# Altium schematic sheet dsPIC.SchDoc: Oncilla motor control board
size A4; DocumentNumber: 3; Revision: 3; SheetNumber: 3; SheetTotal: 5
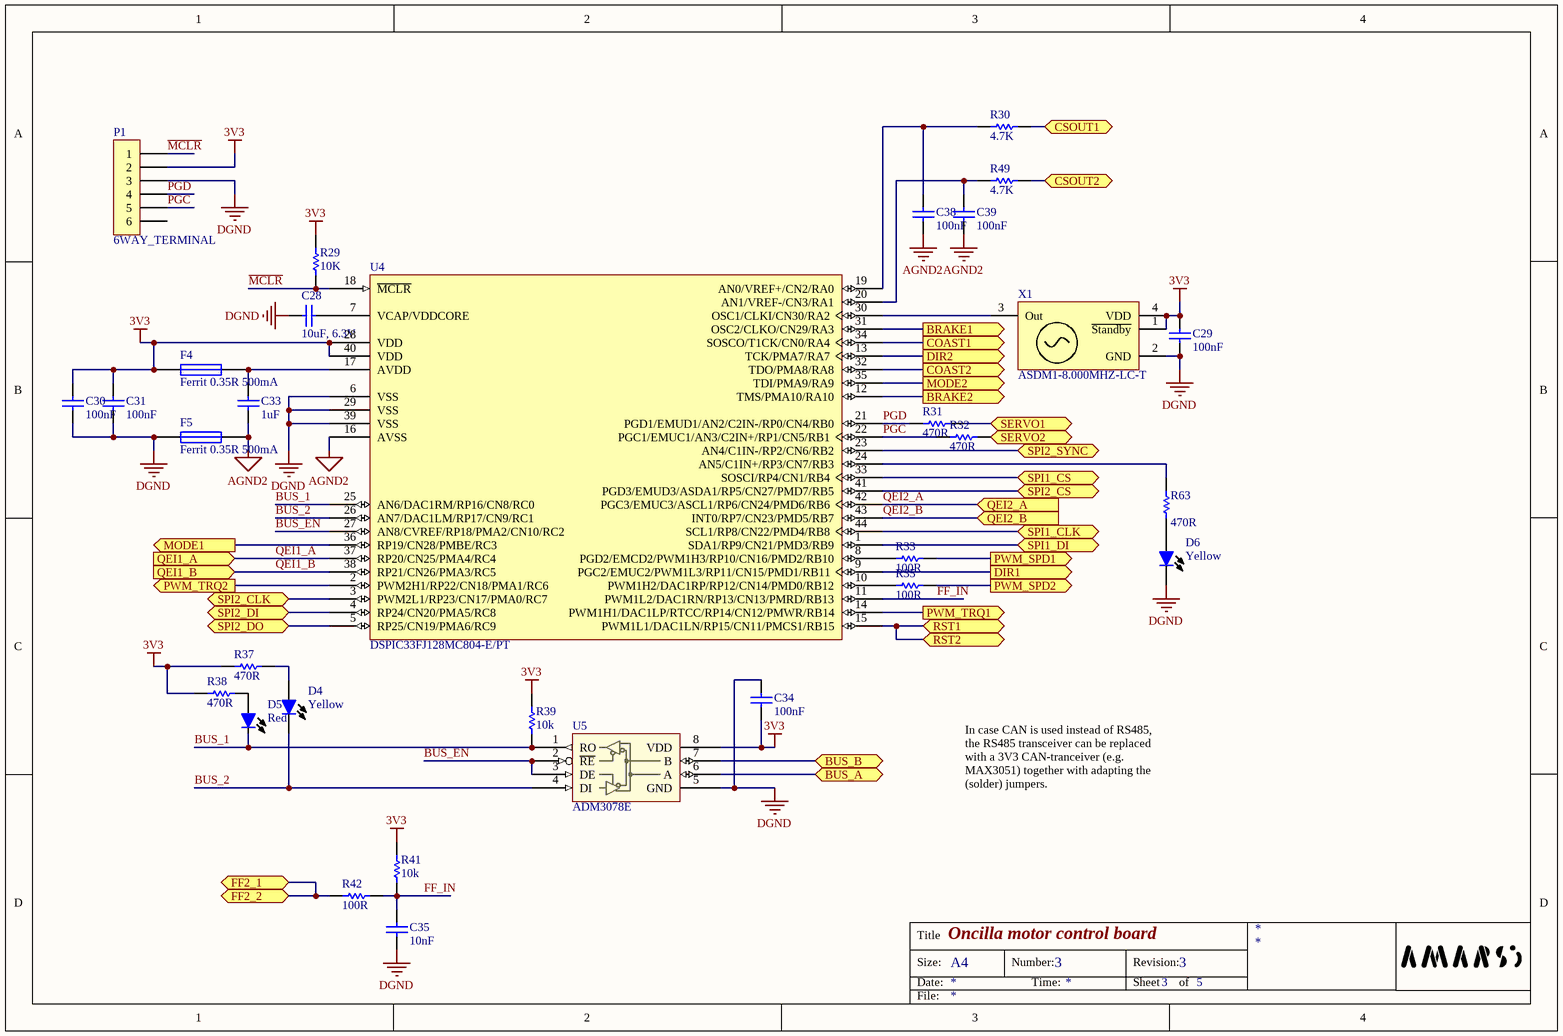
[diagram p0: dsPIC.SchDoc]

## Parts
C28  10uF, 6.3V  [CAPC1608L]
C29  100nF  [CAPC1608L]
C30  100nF  [CAPC1608L]
C31  100nF  [CAPC1608L]
C33  value 1uF  [CAPC1608L]  (hidden comment: 1uF, 25V)
C34  100nF  [CAPC1608L]
C35  10nF  [CAPC1608L]
C38  100nF  [CAPC1608L]
C39  100nF  [CAPC1608L]
D4  Color: Yellow  [CD1608-0603]  (hidden comment: LED Yellow)
D5  Color: Red  [CD1608-0603]  (hidden comment: LED Red)
D6  Color: Yellow  [CD1608-0603]  (hidden comment: LED Green)
F4  Ferrit 0.35R 500mA  [RESC1608L]
F5  Ferrit 0.35R 500mA  [RESC1608L]
P1  6WAY_TERMINAL  [MICROMATCH_6WAY_SE]
R29  10k  [RESC1608L]
R30  4.7k  [RESC1608L]
R31  470R  [RESC1608L]
R32  470R  [RESC1608L]
R33  100R  [RESC1608L]
R35  100R  [RESC1608L]
R37  470R  [RESC1608L]
R38  470R  [RESC1608L]
R39  10k  [RESC1608L]
R41  10k  [RESC1608L]
R42  100R  [RESC1608L]
R49  4.7k  [RESC1608L]
R63  470R  [RESC1608L]
U4  DSPIC33FJ128MC804-E/PT  [TQFP-PT44_N]
U5  ADM3078E  [SOIC-8_M]
X1  ASDM1-8.000MHZ-LC-T  [Crystal-Oscillator-2520]

## Ports
BRAKE1 (out), BRAKE2 (out), BUS_A, BUS_B, COAST1 (out), COAST2 (out), CSOUT1, CSOUT2, DIR1 (out), DIR2 (out), FF2_1, FF2_2, MODE1 (out), MODE2 (out), PWM_SPD1 (out), PWM_SPD2 (out), PWM_TRQ1 (out), PWM_TRQ2 (out), QEI1_A (in), QEI1_B (in), QEI2_A (in), QEI2_B (in), RST1, RST2, SERVO1 (bidir), SERVO2 (bidir), SPI1_CLK, SPI1_CS, SPI1_DI, SPI2_CLK, SPI2_CS, SPI2_DI, SPI2_DO, SPI2_SYNC

## Nets
3V3: C29.2 C30.2 C31.2 C34.1 F4.1 P1.2 R29.2 R37.1 R38.1 R39.2 R41.2 U4.28(VDD) U4.40(VDD) U5.8(VDD) X1.1(~{Standby}) X1.4(VDD)
AGND2: C33.1 C38.1 C39.1 F5.2 U4.16(AVSS)
DGND: C28.1 C29.1 C30.1 C31.1 C34.2 C35.1 D6.2(C) F5.1 P1.3 U4.6(VSS) U4.29(VSS) U4.39(VSS) U5.5(GND) X1.2(GND)
BRAKE1: U4.31(OSC2/CLKO/CN29/RA3) ; port BRAKE1
BRAKE2: U4.12(TMS/PMA10/RA10) ; port BRAKE2
BUS_1: D5.2(C) R39.1 U4.25(AN6/DAC1RM/RP16/CN8/RC0) U5.1(RO)
BUS_2: D4.2(C) U4.26(AN7/DAC1LM/RP17/CN9/RC1) U5.4(DI)
BUS_A: U5.6(A) ; port BUS_A
BUS_B: U5.7(B) ; port BUS_B
BUS_EN: U4.27(AN8/CVREF/RP18/PMA2/CN10/RC2) U5.2(~{RE}) U5.3(DE)
COAST1: U4.34(SOSCO/T1CK/CN0/RA4) ; port COAST1
COAST2: U4.32(TDO/PMA8/RA8) ; port COAST2
CSOUT1: R30.2 ; port CSOUT1
CSOUT2: R49.2 ; port CSOUT2
DIR1: U4.9(PGC2/EMUC2/PWM1L3/RP11/CN15/PMD1/RB11) ; port DIR1
DIR2: U4.13(TCK/PMA7/RA7) ; port DIR2
FF2_1: R42.2 ; port FF2_2, port FF2_1
FF_IN: C35.2 R41.1 R42.1 U4.11(PWM1L2/DAC1RN/RP13/CN13/PMRD/RB13)
~{MCLR}: P1.1 R29.1 U4.18(~{MCLR})
MODE1: U4.36(RP19/CN28/PMBE/RC3) ; port MODE1
MODE2: U4.35(TDI/PMA9/RA9) ; port MODE2
PGC: P1.5 R32.1 U4.22(PGC1/EMUC1/AN3/C2IN+/RP1/CN5/RB1)
PGD: P1.4 R31.1 U4.21(PGD1/EMUD1/AN2/C2IN-/RP0/CN4/RB0)
PWM_SPD1: R33.2 ; port PWM_SPD1
PWM_SPD2: R35.2 ; port PWM_SPD2
PWM_TRQ1: U4.14(PWM1H1/DAC1LP/RTCC/RP14/CN12/PMWR/RB14) ; port PWM_TRQ1
PWM_TRQ2: U4.2(PWM2H1/RP22/CN18/PMA1/RC6) ; port PWM_TRQ2
QEI1_A: U4.37(RP20/CN25/PMA4/RC4) ; port QEI1_A
QEI1_B: U4.38(RP21/CN26/PMA3/RC5) ; port QEI1_B
QEI2_A: U4.42(PGC3/EMUC3/ASCL1/RP6/CN24/PMD6/RB6) ; port QEI2_A
QEI2_B: U4.43(INT0/RP7/CN23/PMD5/RB7) ; port QEI2_B
RST1: U4.15(PWM1L1/DAC1LN/RP15/CN11/PMCS1/RB15) ; port RST1, port RST2
SERVO1: R31.2 ; port SERVO1
SERVO2: R32.2 ; port SERVO2
SPI1_CLK: U4.44(SCL1/RP8/CN22/PMD4/RB8) ; port SPI1_CLK
SPI1_CS: U4.33(SOSCI/RP4/CN1/RB4) ; port SPI1_CS
SPI1_DI: U4.1(SDA1/RP9/CN21/PMD3/RB9) ; port SPI1_DI
SPI2_CLK: U4.3(PWM2L1/RP23/CN17/PMA0/RC7) ; port SPI2_CLK
SPI2_CS: U4.41(PGD3/EMUD3/ASDA1/RP5/CN27/PMD7/RB5) ; port SPI2_CS
SPI2_DI: U4.4(RP24/CN20/PMA5/RC8) ; port SPI2_DI
SPI2_DO: U4.5(RP25/CN19/PMA6/RC9) ; port SPI2_DO
SPI2_SYNC: U4.23(AN4/C1IN-/RP2/CN6/RB2) ; port SPI2_SYNC
NetC28_2: C28.2 U4.7(VCAP/VDDCORE)
NetC33_2: C33.2 F4.2 U4.17(AVDD)
NetC38_2: C38.2 R30.1 U4.19(AN0/VREF+/CN2/RA0)
NetC39_2: C39.2 R49.1 U4.20(AN1/VREF-/CN3/RA1)
NetD4_1: D4.1(A) R37.2
NetD5_1: D5.1(A) R38.2
NetD6_1: D6.1(A) R63.1
NetR33_1: R33.1 U4.8(PGD2/EMCD2/PWM1H3/RP10/CN16/PMD2/RB10)
NetR35_1: R35.1 U4.10(PWM1H2/DAC1RP/RP12/CN14/PMD0/RB12)
NetR63_2: R63.2 U4.24(AN5/C1IN+/RP3/CN7/RB3)
NetU4_30: U4.30(OSC1/CLKI/CN30/RA2) X1.3(Out)

Not connected (* = marked no-connect by the designer): P1 6

## Notes on the sheet
- In case CAN is used instead of RS485, the RS485 transceiver can be replaced with a 3V3 CAN-tranceiver (e.g. MAX3051) together with adapting the (solder) jumpers.
- Title
- Size:
- Date:
- A4
- Number:
- Time:
- Revision:
- Sheet
- of
- File:

## Library data of the parts
C28-C31 C33-C35 C38 C39 = Cap Semi: Capacitor (Semiconductor SIM Model); Published: 8-Jun-2000; LatestRevisionDate: 29-May-2009; LatestRevisionNote: IPC-7351 Footprint Added.; PackageReference: C1206; Publisher: Altium Limited; PackageDescription: Chip Capacitor
  C28: Value: 10uF, 6.3V
  C29-C31 C34 C38 C39: Value: 100nF
  C35: Value: 10nF
D4-D6 = LED
F4 F5 = Fuse 1: Ferrit Bead; Published: 8-Jun-2000; LatestRevisionDate: 17-Jul-2002; LatestRevisionNote: Re-released for DXP Platform.; PackageReference: PIN-W2/E2.8; Publisher: Altium Limited
R29-R33 R35 R37-R39 R41 R42 R49 R63 = Res Semi: Semiconductor Resistor; Published: 8-Jun-2000; LatestRevisionDate: 17-Jul-2002; LatestRevisionNote: Re-released for DXP Platform.; PackageReference: AXIAL-0.5; Publisher: Altium Limited
  R29: Value: 10K
  R30 R49: Value: 4.7K
  R31 R32 R37 R38 R63: Value: 470R
  R33 R35 R42: Value: 100R
  R39 R41: Value: 10k
U4 = DSPIC33FJ128MC804-E/PT: High-Performance 16-bit Digital Signal Controller, 128 KB Flash, 16 KB RAM, 44-Pin TQFP, Extended High Temperature; FirstPublished: 29-Jan-2009; LatestRevisionDate: 02-Dec-2009; LatestRevisionNote: Updated to datasheet revision D, Nov-2009; DatasheetVersion: revD, Nov-2009; PackageVersion: revBB, Aug-2009; PackageReference: TQFP-PT44; Publisher: Altium Limited; PackageDescription: 44-Lead Plastic Thin Quad Flatpack (PT) - 10x10x1mm Body, 2.00mm [TQFP]; Supplier 1: Digi-Key; Supplier Part Number 1: DSPIC33FJ128MC804-E/PT-ND; Supplier 2: Newark; Supplier Part Number 2: 39M8144; Code_JEDEC: MS-026; ComponentLink1Description: Datasheet; ComponentLink1URL: http://ww1.microchip.com/downloads/en/DeviceDoc/70291D.pdf; ComponentLink2Description: Packaging Specification; ComponentLink2URL: http://www.microchip.com/stellent/groups/techpub_sg/documents/packagingspec/en012702.pdf; ComponentLink3Description: Microchip.com Home; ComponentLink3URL: http://www.microchip.com/
U5 = ADM3078E: Half-Duplex RS485 Transciever, 3.3V, 16Mbps
X1 = Oscillator: Name: ASDM1; Value: 8MHz